# Altium schematic sheet Main_MCU_NuM487KM.SchDoc
size A4
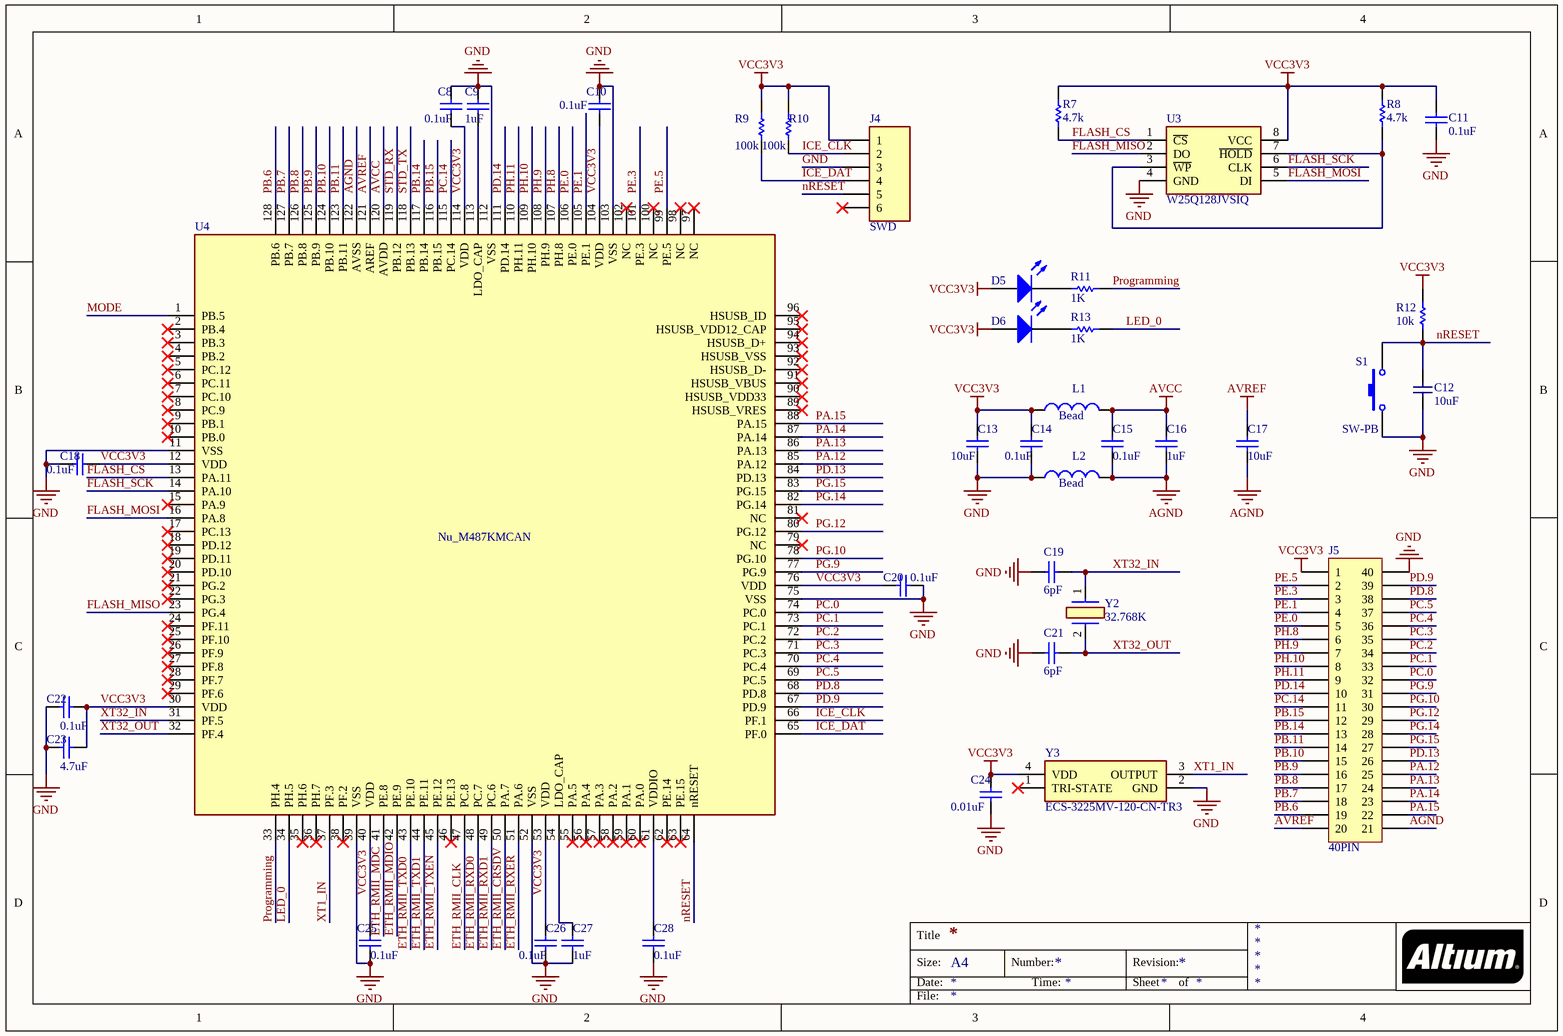
[diagram p0: Main_MCU_NuM487KM.SchDoc]

## Parts
C8  0.1uF  [SMD0603]
C9  1uF  [SMD0603]
C10  0.1uF  [SMD0603]
C11  0.1uF  [SMD0603]
C12  10uF  [SMD0603]
C13  10uF  [SMD0603]
C14  0.1uF  [SMD0603]
C15  0.1uF  [SMD0603]
C16  1uF  [SMD0603]
C17  10uF  [SMD0603]
C18  0.1uF  [SMD0603]
C19  6pF  [SMD0603]
C20  0.1uF  [SMD0603]
C21  6pF  [SMD0603]
C22  0.1uF  [SMD0603]
C23  4.7uF  [SMD0603]
C24  0.01uF  [SMD0603]
C25  0.1uF  [SMD0603]
C26  0.1uF  [SMD0603]
C27  1uF  [SMD0603]
C28  0.1uF  [SMD0603]
D5  LED0  [SMD0603_LED]  (value not drawn)
D6  LED0  [SMD0603_LED]  (value not drawn)
J4  SWD  [ISP]
J5  40PIN  [40PIN]
L1  Bead  [SMD0603]
L2  Bead  [SMD0603]
R7  4.7k  [SMD0603]
R8  4.7k  [SMD0603]
R9  100K  [SMD0603]
R10  100K  [SMD0603]
R11  1K  [SMD0603]
R12  10K  [SMD0603]
R13  1K  [SMD0603]
S1  SW-PB  [Button]
U3  W25Q128JVSIQ  [SOIC127P790X216-8N]
U4  Nu_M487KMCAN  [QFP40P1600X1600X120-128N]
Y2  32.768K  [ECS327634RTR]
Y3  ECS-3225MV-120-CN-TR3  [OSC3225]

## Nets
AGND: C15.2 C16.2 C17.2 J5.21 L2.2 U4.122(AVSS)
AVCC: C15.1 C16.1 L1.2 U4.120(AVDD)
AVREF: C17.1 J5.20 U4.121(AREF)
GND: C8.2 C9.1 C10.2 C11.2 C12.1 C13.2 C14.2 C18.2 C19.2 C20.1 C21.2 C22.2 C23.2 C24.1 C25.1 C26.1 C27.1 C28.1 J4.3 J5.40 L2.1 S1.1 U3.4(GND) U4.11(VSS) U4.39(VSS) U4.52(VSS) U4.75(VSS) U4.103(VSS) U4.112(VSS) Y3.2(GND)
VCC3V3: C8.1 C10.1 C11.1 C13.1 C14.1 C18.1 C20.2 C22.1 C23.1 C24.2 C25.2 C26.2 D5.1(A) D6.1(A) J4.1 J5.1 L1.1 R7.2 R8.2 R9.2 R10.2 R12.2 U3.8(VCC) U4.12(VDD) U4.30(VDD) U4.40(VDD) U4.53(VDD) U4.76(VDD) U4.104(VDD) U4.114(VDD) Y3.4(VDD)
ETH_RMII_CLK: U4.47(PC.8)
ETH_RMII_CRSDV: U4.50(PA.7)
ETH_RMII_MDC: U4.41(PE.8)
ETH_RMII_MDIO: U4.42(PE.9)
ETH_RMII_RXD0: U4.48(PC.7)
ETH_RMII_RXD1: U4.49(PC.6)
ETH_RMII_RXER: U4.51(PA.6)
ETH_RMII_TXD0: U4.43(PE.10)
ETH_RMII_TXD1: U4.44(PE.11)
ETH_RMII_TXEN: U4.45(PE.12)
FLASH_CS: R7.1 U3.1(~{CS}) U4.13(PA.11)
FLASH_MISO: U3.2(DO) U4.23(PG.4)
FLASH_MOSI: U3.5(DI) U4.16(PA.8)
FLASH_SCK: U3.6(CLK) U4.14(PA.10)
ICE_CLK: J4.2 R10.1 U4.66(PF.1)
ICE_DAT: J4.4 R9.1 U4.65(PF.0)
LED_0: R13.1 U4.34(PH.5)
MODE: U4.1(PB.5)
nRESET: C12.2 J4.5 R12.1 S1.2 U4.64(nRESET)
PA.12: J5.25 U4.85(PA.12)
PA.13: J5.24 U4.86(PA.13)
PA.14: J5.23 U4.87(PA.14)
PA.15: J5.22 U4.88(PA.15)
PB.6: J5.19 U4.128(PB.6)
PB.7: J5.18 U4.127(PB.7)
PB.8: J5.17 U4.126(PB.8)
PB.9: J5.16 U4.125(PB.9)
PB.10: J5.15 U4.124(PB.10)
PB.11: J5.14 U4.123(PB.11)
PB.14: J5.13 U4.117(PB.14)
PB.15: J5.12 U4.116(PB.15)
PC.0: J5.32 U4.74(PC.0)
PC.1: J5.33 U4.73(PC.1)
PC.2: J5.34 U4.72(PC.2)
PC.3: J5.35 U4.71(PC.3)
PC.4: J5.36 U4.70(PC.4)
PC.5: J5.37 U4.69(PC.5)
PC.14: J5.11 U4.115(PC.14)
PD.8: J5.38 U4.68(PD.8)
PD.9: J5.39 U4.67(PD.9)
PD.13: J5.26 U4.84(PD.13)
PD.14: J5.10 U4.111(PD.14)
PE.0: J5.5 U4.106(PE.0)
PE.1: J5.4 U4.105(PE.1)
PE.3: J5.3 U4.101(PE.3)
PE.5: J5.2 U4.99(PE.5)
PG.9: J5.31 U4.77(PG.9)
PG.10: J5.30 U4.78(PG.10)
PG.12: J5.29 U4.80(PG.12)
PG.14: J5.28 U4.82(PG.14)
PG.15: J5.27 U4.83(PG.15)
PH.8: J5.6 U4.107(PH.8)
PH.9: J5.7 U4.108(PH.9)
PH.10: J5.8 U4.109(PH.10)
PH.11: J5.9 U4.110(PH.11)
Programming: R11.1 U4.33(PH.4)
STD_RX: U4.119(PB.12)
STD_TX: U4.118(PB.13)
XT1_IN: U4.37(PF.3) Y3.3(OUTPUT)
XT32_IN: C19.1 U4.31(PF.5) Y2.1(OUT/IN)
XT32_OUT: C21.1 U4.32(PF.4) Y2.2(OUT/IN)
NetC9_2: C9.2 U4.113(LDO_CAP)
NetC27_2: C27.2 U4.54(LDO_CAP)
NetC28_2: C28.2 U4.61(VDDIO)
NetD5_2: D5.2(K) R11.2
NetD6_2: D6.2(K) R13.2
NetR8_1: R8.1 U3.3(~{WP}) U3.7(~{HOLD})

Not connected (* = marked no-connect by the designer): J4 6*; U4 2(PB.4)* 3(PB.3)* 4(PB.2)* 5(PC.12)* 6(PC.11)* 7(PC.10)* 8(PC.9)* 9(PB.1)* 10(PB.0)* 15(PA.9)* 17(PC.13)* 18(PD.12)* 19(PD.11)* 20(PD.10)* 21(PG.2)* 22(PG.3)* 24(PF.11)* 25(PF.10)* 26(PF.9)* 27(PF.8)* 28(PF.7)* 29(PF.6)* 35(PH.6)* 36(PH.7)* 38(PF.2)* 46(PE.13)* 55(PA.5)* 56(PA.4)* 57(PA.3)* 58(PA.2)* 59(PA.1)* 60(PA.0)* 62(PE.14)* 63(PE.15)* 79(NC)* 81(NC)* 89(HSUSB_VRES)* 90(HSUSB_VDD33)* 91(HSUSB_VBUS)* 92(HSUSB_D-)* 93(HSUSB_VSS)* 94(HSUSB_D+)* 95(HSUSB_VDD12_CAP)* 96(HSUSB_ID)* 97(NC)* 98(NC)* 100(NC)* 102(NC)*; Y3 1(TRI-STATE)*

## Notes on the sheet
- Title
- Size:
- Date:
- A4
- Number:
- Time:
- Revision:
- Sheet
- of
- File:

## Library data of the parts
C8-C11 C13-C28 = Cap Semi: Capacitor (Semiconductor SIM Model); Published: 8-Jun-2000; LatestRevisionDate: 29-May-2009; LatestRevisionNote: IPC-7351 Footprint Added.; PackageReference: C1206; Publisher: Altium Limited; PackageDescription: Chip Capacitor
  C8 C10 C11 C14 C15 C18 C20 C22 C25 C26 C28: Value: 0.1uF
  C9 C16 C27: Value: 1uF
  C13 C17: Value: 10uF
  C19 C21: Value: 6pF
  C23: Value: 4.7uF
  C24: Value: 0.01uF
C12 = Cap: Capacitor (Semiconductor SIM Model); Value: 10uF
D5 D6 = LED0: Typical INFRARED GaAs LED; Published: 8-Jun-2000; LatestRevisionDate: 08-Jul-2005; LatestRevisionNote: Mech Layer 1 removed.; PackageReference: LED-0; Publisher: Altium Limited; PackageDescription: LED; 2 Leads
J5 = 2x20_header
L1 L2 = Inductor: Code_IEC: 1005; Published: 8-Jun-2000; LatestRevisionDate: 29-May-2009; LatestRevisionNote: IPC-7351 Footprint Added.; PackageReference: 0402-A; Publisher: Altium Limited; PackageDescription: Chip Inductor; Code_JEITA: 0402; Value: Bead
R7-R10 R12 = Res: Semiconductor Resistor
  R7 R8: Value: 4.7k
  R9 R10: Value: 100k
  R12: Value: 10k
R11 R13 = Res Semi: Semiconductor Resistor; Published: 8-Jun-2000; LatestRevisionDate: 17-Jul-2002; LatestRevisionNote: Re-released for DXP Platform.; PackageReference: AXIAL-0.5; Publisher: Altium Limited; PackageDescription: Axial Device, Thru-Hole; 2 Leads; 0.5 in Pin Spacing; Value: 1K
S1 = SW-PB: Switch; Published: 24-Mar-1999; LatestRevisionDate: 17-Jul-2002; LatestRevisionNote: Re-released for DXP Platform.; PackageReference: SPST-2; Publisher: Altium Limited; PackageDescription: Switch; 2 Leads
U3 = W25Q128JVSIQ: Integrated Circuit; Manufacturer_Name: Winbond; Datasheet Link: https://componentsearchengine.com//W25Q128JVSIQ.pdf; Height: 2.16mm; Mouser2 Part Number: 454-W25Q128JVSIQ; Mouser2 Price/Stock: https://www.mouser.com/Search/Refine.aspx?Keyword=454-W25Q128JVSIQ; Manufacturer_Part_Number: W25Q128JVSIQ
U4 = Nu_M487KMCAN: Integrated Circuit
Y2 = ECS-.327-6-34R-TR: Crystal or Oscillator; Manufacturer_Name: ECS; Datasheet Link: https://ecsxtal.com/store/pdf/ECX_34R.pdf; Height: 0.9mm; Manufacturer_Part_Number: ECS-.327-6-34R-TR
Y3 = ECS-3225MV-120-CN-TR3: Crystal or Oscillator; Manufacturer_Name: ECS; Datasheet Link: https://ecsxtal.com/store/pdf/ECS-3225MV.pdf; Height: 1.2mm; Manufacturer_Part_Number: ECS-3225MV-120-CN-TR3